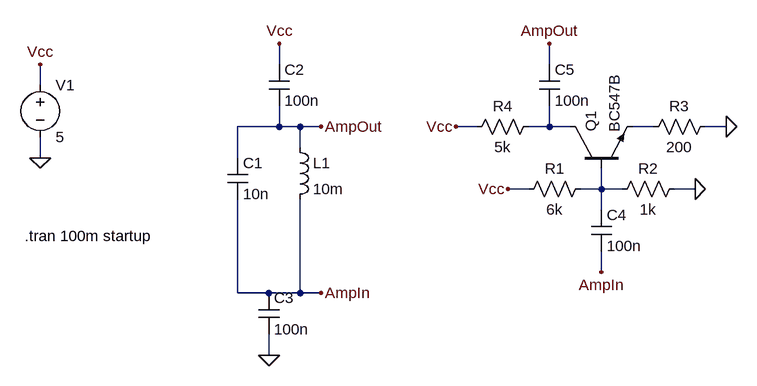
[diagram p0: schematic LCTankOscillator-v3.asc]
LCTankOscillator-v3.asc, the LTspice schematic file:
Version 4
SHEET 1 880 680
WIRE -48 -16 -48 -48
WIRE 368 -16 368 -48
WIRE -416 16 -416 -16
WIRE -48 80 -48 48
WIRE -48 80 -112 80
WIRE -16 80 -48 80
WIRE 16 80 -16 80
WIRE 256 80 224 80
WIRE 368 80 368 48
WIRE 368 80 336 80
WIRE 400 80 368 80
WIRE 528 80 496 80
WIRE 640 80 608 80
WIRE -16 112 -16 80
WIRE -416 128 -416 96
WIRE -112 128 -112 80
WIRE 336 176 304 176
WIRE 448 176 448 144
WIRE 448 176 416 176
WIRE 480 176 448 176
WIRE 592 176 560 176
WIRE 448 208 448 176
WIRE 448 304 448 272
WIRE -112 336 -112 192
WIRE -64 336 -112 336
WIRE -16 336 -16 192
WIRE -16 336 -64 336
WIRE 16 336 -16 336
WIRE -64 432 -64 400
FLAG -416 128 0
FLAG -416 -16 Vcc
FLAG -64 432 0
FLAG -48 -48 Vcc
FLAG 16 336 AmpIn
FLAG 16 80 AmpOut
FLAG 592 176 0
FLAG 304 176 Vcc
FLAG 448 304 AmpIn
FLAG 640 80 0
FLAG 224 80 Vcc
FLAG 368 -48 AmpOut
SYMBOL cap -128 128 R0
SYMATTR InstName C1
SYMATTR Value 10n
SYMBOL ind -32 96 R0
SYMATTR InstName L1
SYMATTR Value 10m
SYMBOL voltage -416 0 R0
WINDOW 123 0 0 Left 0
WINDOW 39 0 0 Left 0
SYMATTR InstName V1
SYMATTR Value 5
SYMBOL cap -64 -16 R0
SYMATTR InstName C2
SYMATTR Value 100n
SYMBOL cap -80 336 R0
SYMATTR InstName C3
SYMATTR Value 100n
SYMBOL npn 400 144 R270
SYMATTR InstName Q1
SYMATTR Value BC547B
SYMBOL cap 432 208 R0
SYMATTR InstName C4
SYMATTR Value 100n
SYMBOL res 432 160 R90
WINDOW 0 0 56 VBottom 2
WINDOW 3 32 56 VTop 2
SYMATTR InstName R1
SYMATTR Value 6k
SYMBOL res 576 160 R90
WINDOW 0 0 56 VBottom 2
WINDOW 3 32 56 VTop 2
SYMATTR InstName R2
SYMATTR Value 1k
SYMBOL res 624 64 R90
WINDOW 0 0 56 VBottom 2
WINDOW 3 32 56 VTop 2
SYMATTR InstName R3
SYMATTR Value 200
SYMBOL res 352 64 R90
WINDOW 0 0 56 VBottom 2
WINDOW 3 32 56 VTop 2
SYMATTR InstName R4
SYMATTR Value 5k
SYMBOL cap 352 -16 R0
SYMATTR InstName C5
SYMATTR Value 100n
TEXT -440 248 Left 2 !.tran 100m startup

The netlist it stands for:
* LCTankOscillator-v3.asc
C1 AmpOut AmpIn 10n
L1 AmpOut AmpIn 10m
V1 Vcc 0 5
C2 Vcc AmpOut 100n
C3 AmpIn 0 100n
Q1 N001 N003 N002 0 BC547B
C4 N003 AmpIn 100n
R1 N003 Vcc 6k
R2 0 N003 1k
R3 0 N002 200
R4 N001 Vcc 5k
C5 AmpOut N001 100n
.model NPN NPN
.model PNP PNP
.lib standard.bjt
.tran 100m startup
.backanno
.end